# Altium schematic sheet Power_Supply.SchDoc: Power Supply
size A4; Date: 2024/09/14; Author: kysdfcc; CompanyName: 南京林业大学 信息科学技术学院; SheetNumber: 1; SheetTotal: 2
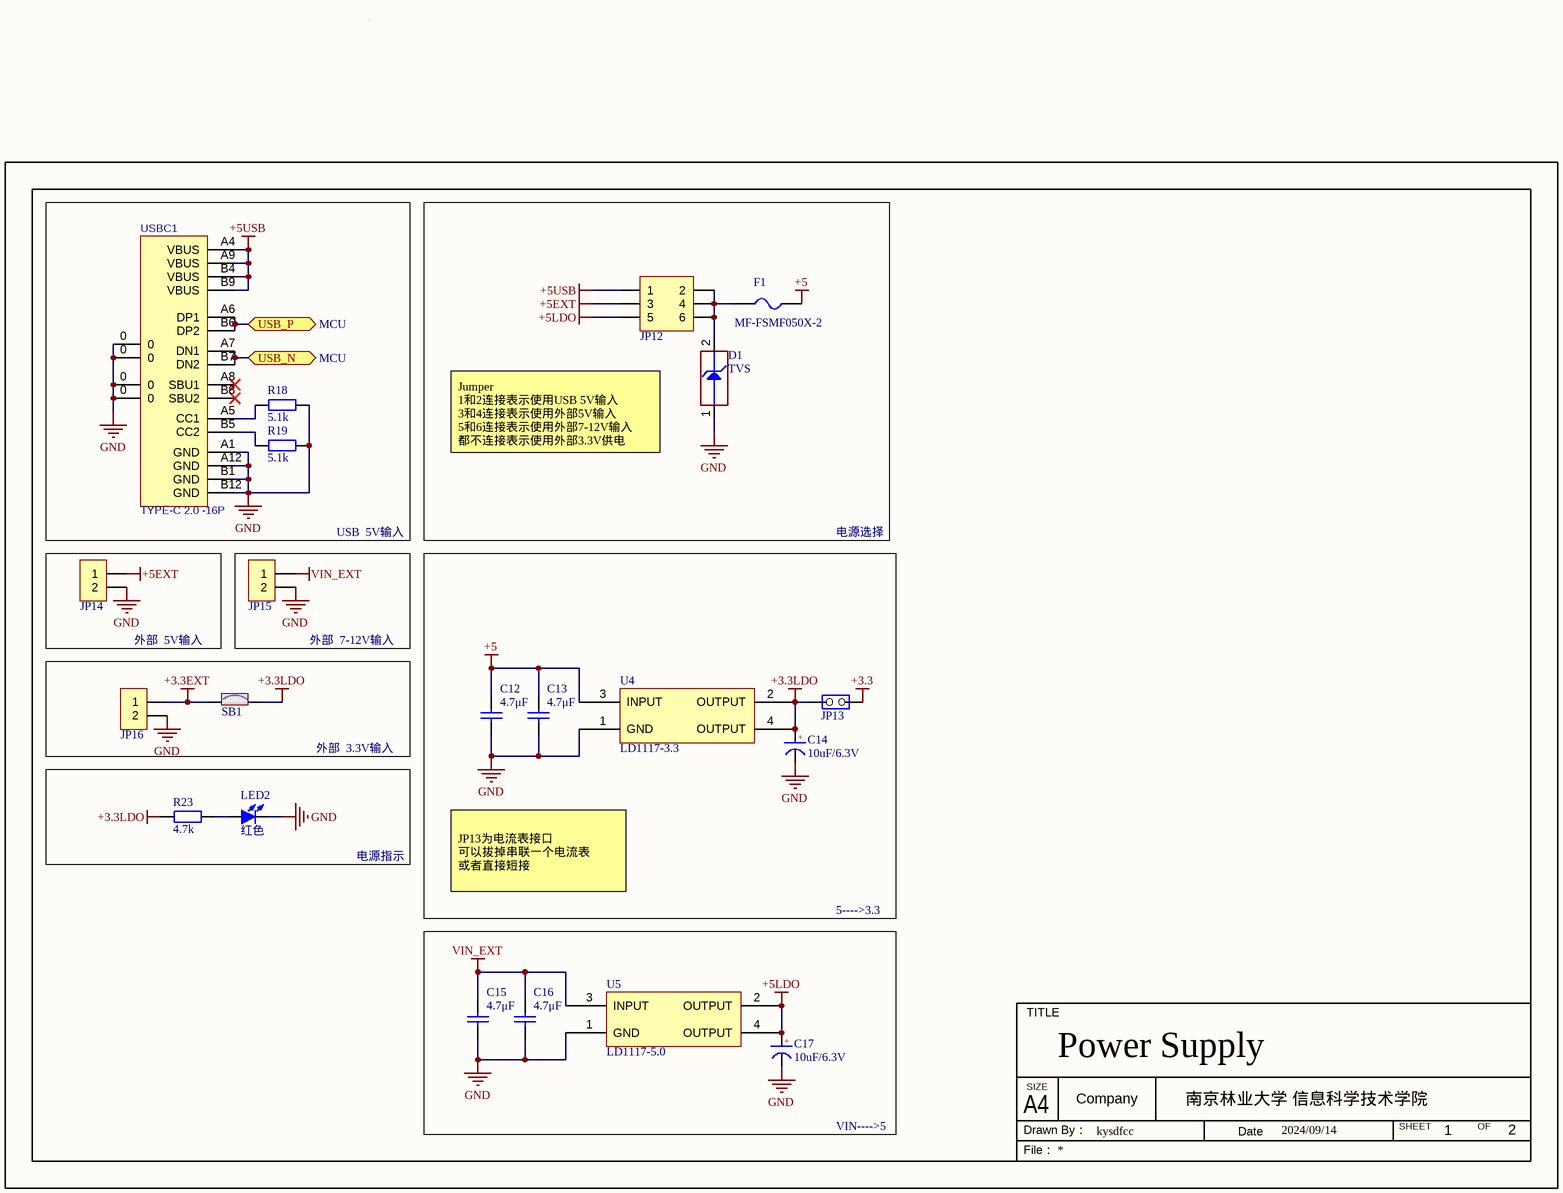
[diagram p0: Power_Supply.SchDoc]

## Parts
C12  4.7μF  [C 0603_L]
C13  4.7μF  [C 0603_L]
C14  10uF/6.3V  [CD A(3216)]
C15  4.7μF  [C 0603_L]
C16  4.7μF  [C 0603_L]
C17  10uF/6.3V  [CD A(3216)]
D1  TVS  [SOD-123]
F1  MF-FSMF050X-2  [FU 0603]
JP12  Header3X2  [HDR2.54-LI-2x3P]  (value not drawn)
JP13  Jumper_Header 2x1  [CON_SAMTEC_TSW-102-07-G-S]  (value not drawn)
JP14  HDR-1X2  [HDR2.54-LI-2P]  (value not drawn)
JP15  HDR-1X2  [HDR2.54-LI-2P]  (value not drawn)
JP16  HDR-1X2  [HDR2.54-LI-2P]  (value not drawn)
LED2  红色  [LED 0603R]
R18  5.1k  [R 0603_L]
R19  5.1k  [R 0603_L]
R23  4.7k  [R 0603_L]
SB1  SB_ON  [SOLDER-BRIDGE_R0603-0R]  (value not drawn)
U4  LD1117-3.3  [LM1117 SOT223]
U5  LD1117-5.0  [LM1117 SOT223]
USBC1  TYPE-C 2.0 -16P  [USB-C-SMD_TYPE-C-USB-5]

## Blocks framed on the sheet
USB  5V输入: R18 R19 USBC1
电源选择: D1 F1 JP12
外部  5V输入: JP14
5---->3.3: C12-C14 JP13 U4

## Ports
USB_N (bidir, see MCU), USB_P (bidir, see MCU)

## Nets
+3.3: JP13.2(NO)
+3.3EXT: JP16.1 SB1.1
+3.3LDO: C14.1(A) JP13.1(COMMON) R23.2 SB1.2 U4.2(OUTPUT) U4.4(OUTPUT)
+5: C12.2 C13.2 F1.2 U4.3(INPUT)
+5EXT: JP12.3 JP14.1
+5LDO: C17.1(A) JP12.5 U5.2(OUTPUT) U5.4(OUTPUT)
+5USB: JP12.1 USBC1.A4(VBUS) USBC1.A9(VBUS) USBC1.B4(VBUS) USBC1.B9(VBUS)
GND: C12.1 C13.1 C14.2(K) C15.1 C16.1 C17.2(K) D1.1(IO1) JP14.2 JP15.2 JP16.2 LED2.2(K) R18.2 R19.2 U4.1(GND) U5.1(GND) USBC1.0 USBC1.A1(GND) USBC1.A12(GND) USBC1.B1(GND) USBC1.B12(GND)
VIN_EXT: C15.2 C16.2 JP15.1 U5.3(INPUT)
USB_N: USBC1.A7(DN1) USBC1.B7(DN2) ; port USB_N
USB_P: USBC1.A6(DP1) USBC1.B6(DP2) ; port USB_P
NetD1_2: D1.2(GND) F1.1 JP12.2 JP12.4 JP12.6
NetLED2_1: LED2.1(A) R23.1
NetR18_1: R18.1 USBC1.A5(CC1)
NetR19_1: R19.1 USBC1.B5(CC2)

Not connected (* = marked no-connect by the designer): USBC1 A8(SBU1)* B8(SBU2)*

## Notes on the sheet
- Jumper
  1和2连接表示使用USB 5V输入
  3和4连接表示使用外部5V输入
  5和6连接表示使用外部7-12V输入
  都不连接表示使用外部3.3V供电
- 外部  7-12V输入
- 外部  3.3V输入
- 电源指示
- JP13为电流表接口
  可以拔掉串联一个电流表
  或者直接短接
- VIN---->5
- TITLE
- SIZE
- A4
- Drawn By：
- File：
- Company
- Date
- SHEET
- OF
- (in symbol CT) +

## Library data of the parts
C12 C13 C15 C16 = C: 贴片电容; Name: 无极性贴片电容
C14 C17 = CT: 贴片钽电容; Name: 贴片钽电容
D1 = TVS: High power Transient voltage suppressor:25V/35A EOS and ESD transients protection.; Internal_Part_Number: MCD-01207; Part_Type: Diode; Manufacturer_Part_Number: ESDA25P35-1U1M; Manufacturer: STMICROELECTRONICS; BMS_Part_Number: 9179045; ECCN_US: EAR99; ECCN_EU: NEC; Provided_By: SUBCO with ST control; Status: Checked; Package: QFN1610; ComponentLink1Description: Datasheet; ComponentLink1URL: http://tunmcdsvn.tun.st.com/Component_Datasheet_Library/Trunk/Diodes/STM_ESD_ESDA25P35-1U1M; Value: TVS
F1 = FU: 贴片保险丝; Name: 贴片保险丝
JP12 = Header 3X2: 3*2P接插件; Name: 3*2P接插件
JP13 = Header 2x1: Header, 2x1, 2,54mm, VR, TH, Height 5.84mm/2.54mm; Internal_Part_Number: MCD-00045; Part_Preference: Recommended; Part_Type: Connector; Manufacturer: SAMTEC; Manufacturer_Part_Number: TSW-102-07-G-S; Alternate_Manufacturer: JIUBABA; LIANYI; Alternate_Manufacturer_Part_Number: 313102S111116;313102S111116; Status: Released; ComponentLink1Description: Datasheet; ComponentLink1URL: http://tunmcdsvn.tun.st.com/Component_Datasheet_Library/Trunk/Connectors/Samtec_TSW-HTSW-series
JP14-JP16 = Header 2: 2P接插件; Name: 2P接插件
LED2 = LED-SMD: 贴片LED; Name: 贴片LED
R18 R19 R23 = R: 贴片电阻; Name: 贴片电阻
SB1 = Solder Bridge: Solder Bridge ON; Internal_Part_Number: MCD-00071; Part_Type: Mechanical; Manufacturer_Part_Number: RC0603JR-070RL; Manufacturer: YAGEO; Provided_By: SUBCO; Status: Released; ComponentLink1Description: Datasheet; Package: SB0603; ComponentLink1URL: http://tunmcdsvn.tun.st.com/Component_Datasheet_Library/Trunk/Resistors/Yageo_Resistor_RC0603-series; ECCN_US: n/a; ECCN_EU: n/a
U4 U5 = LD1117
USBC1 = USB2.0 Type-C 16Pin母座: USB2.0 Type-C 母座 16Pin